# EAGLE design ef01 (EAGLE 7.6.0)
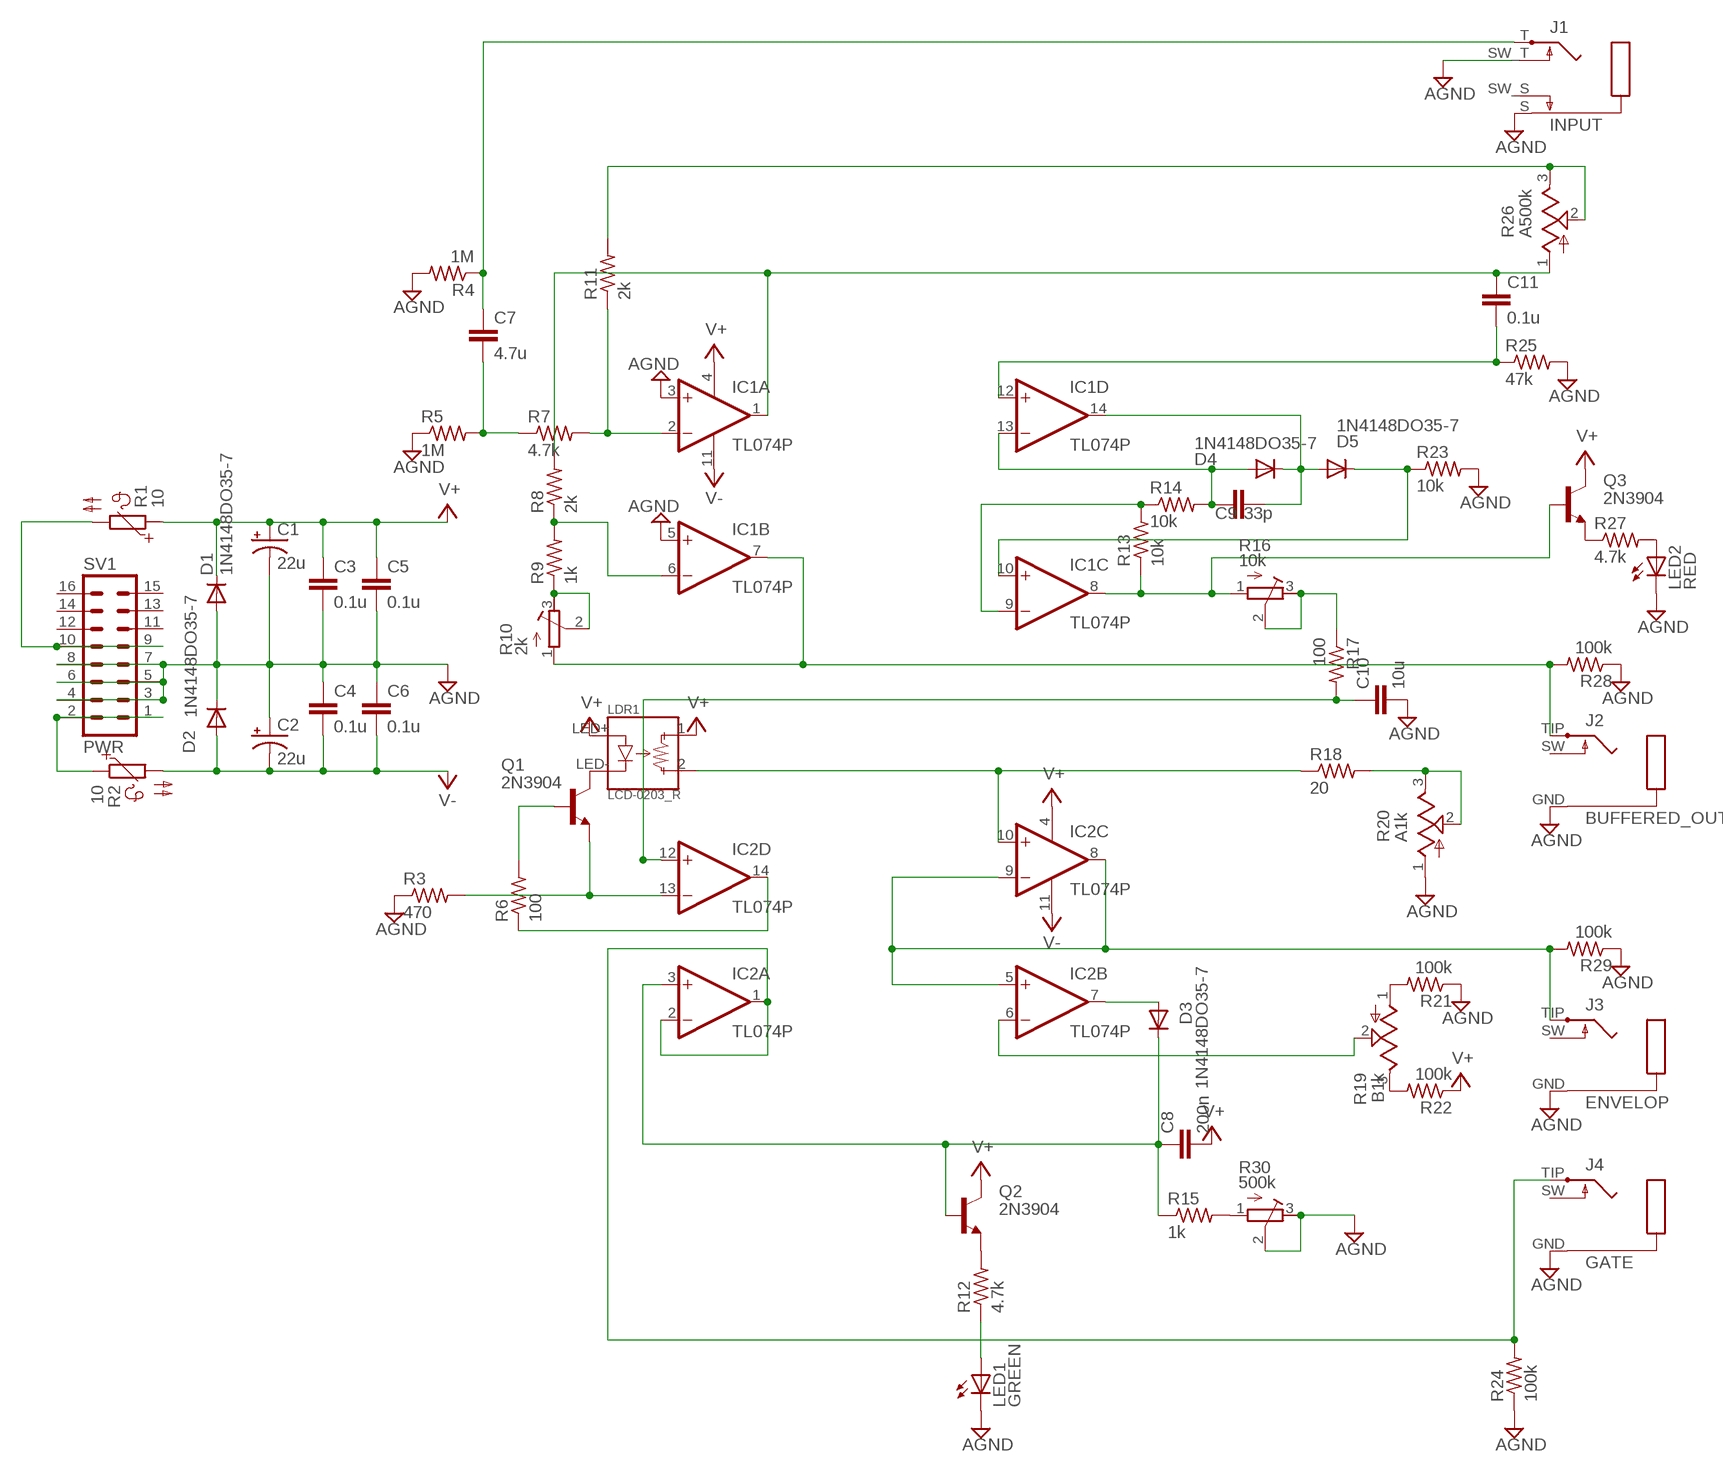
[diagram p0: schematic, sheet 1]

## Parts
C1  22u  CPOL-USE2.5-5  [E2,5-5]
C2  22u  CPOL-USE2.5-5  [E2,5-5]
C3  0.1u  C-EU050-024X044  [C050-024X044]
C4  0.1u  C-EU050-024X044  [C050-024X044]
C5  0.1u  C-EU050-024X044  [C050-024X044]
C6  0.1u  C-EU050-024X044  [C050-024X044]
C7  4.7u  C-EU050-024X044  [C050-024X044]
C8  200n  C-EU050-024X044  [C050-024X044]
C9  33p  C-EU050-024X044  [C050-024X044]
C10  10u  C-EU050-024X044  [C050-024X044]
C11  0.1u  C-EU050-024X044  [C050-024X044]
D1  1N4148DO35-7  [DO35-7]
D2  1N4148DO35-7  [DO35-7]
D3  1N4148DO35-7  [DO35-7]
D4  1N4148DO35-7  [DO35-7]
D5  1N4148DO35-7  [DO35-7]
IC1  TL074P  [DIL14]
IC2  TL074P  [DIL14]
J1  INPUT  ACJM-MHDR  [ACJM-MHDR]
J2  BUFFERED_OUT  35RAPC2AV  [35RAPC2AV]
J3  ENVELOP  35RAPC2AV  [35RAPC2AV]
J4  GATE  35RAPC2AV  [35RAPC2AV]
LDR1  LCD-0203_R  [LCD-0203-R]
LED1  GREEN  LED3MM  [LED3MM]
LED2  RED  LED3MM  [LED3MM]
Q1  2N3904  [TO92]
Q2  2N3904  [TO92]
Q3  2N3904  [TO92]
R1  10  PTC679  [P679]
R2  10  PTC679  [P679]
R3  470  R-US_0204/7  [0204/7]
R4  1M  R-US_0204/7  [0204/7]
R5  1M  R-US_0204/7  [0204/7]
R6  100  R-US_0204/7  [0204/7]
R7  4.7k  R-US_0204/7  [0204/7]
R8  2k  R-US_0204/7  [0204/7]
R9  1k  R-US_0204/7  [0204/7]
R10  2k  GFP063P  [GF063P]
R11  2k  R-US_0204/7  [0204/7]
R12  4.7k  R-US_0204/7  [0204/7]
R13  10k  R-US_0204/7  [0204/7]
R14  10k  R-US_0204/7  [0204/7]
R15  1k  R-US_0204/7  [0204/7]
R16  10k  GFP063P  [GF063P]
R17  100  R-US_0204/7  [0204/7]
R18  20  R-US_0204/7  [0204/7]
R19  B1k  RK097111  [RK097111]
R20  A1k  RK097111  [RK097111]
R21  100k  R-US_0204/7  [0204/7]
R22  100k  R-US_0204/7  [0204/7]
R23  10k  R-US_0204/7  [0204/7]
R24  100k  R-US_0204/7  [0204/7]
R25  47k  R-US_0204/7  [0204/7]
R26  A500k  RK097111  [RK097111]
R27  4.7k  R-US_0204/7  [0204/7]
R28  100k  R-US_0204/7  [0204/7]
R29  100k  R-US_0204/7  [0204/7]
R30  500k  GFP063P  [GF063P]
SV1  PWR  ML16  [ML16]

## Nets
AGND [AGND]: C1.- C2.+ C3.2 C4.1 C5.2 C6.1 C10.2 D1.A D2.C IC1.3(A:+IN) IC1.5(B:+IN) J1.S(GND) J1.SW_T(T_SW) J2.GND J3.GND J4.GND LED1.K(C) LED2.K(C) R3.1 R4.2 R5.1 R20.1 R21.1 R23.2 R24.1 R25.2 R28.1 R29.1 R30.2 R30.3 SV1.3 SV1.4 SV1.5 SV1.6 SV1.7 SV1.8
LDR1: C10.1 IC2.12(D:+IN) R17.2
N$1: C7.1 J1.T(TIP) R4.1
N$2: C7.2 R5.2 R7.1
N$3: Q1.2(B) R6.2
N$4: IC1.6(B:-IN) R8.1 R9.2
N$5: R9.1 R10.2 R10.3
N$6: C11.1 IC1.1(A:OUT) R8.2 R26.1
N$7: IC1.7(B:OUT) J2.TIP R10.1 R28.2
N$8: IC1.2(A:-IN) R7.2 R11.1
N$9: C11.2 IC1.12(D:+IN) R25.1
N$10: C9.1 D4.A IC1.13(D:-IN) R14.2
N$11: IC1.8(C:OUT) Q3.2(B) R13.1 R16.1
N$12: R16.2 R16.3 R17.1
N$13: LDR1.LED-(D-) Q1.1(C)
N$14: IC1.9(C:-IN) R13.2 R14.1
N$15: C9.2 D4.C D5.A IC1.14(D:OUT)
N$16: D5.C IC1.10(C:+IN) R23.1
N$17: Q3.3(E) R27.1
N$18: LED2.A R27.2
N$19: IC2.13(D:-IN) Q1.3(E) R3.2
N$20: IC2.14(D:OUT) R6.1
N$21: R18.2 R20.2 R20.3
N$22: IC2.10(C:+IN) LDR1.2 R18.1
N$23: R15.2 R30.1
N$24: IC2.5(B:+IN) IC2.8(C:OUT) IC2.9(C:-IN) J3.TIP R29.2
N$25: R19.1 R21.2
N$26: R19.3 R22.2
N$27: IC2.6(B:-IN) R19.2
N$28: D3.A IC2.7(B:OUT)
N$29: Q2.3(E) R12.2
N$30: LED1.A R12.1
N$31: C8.1 D3.C IC2.3(A:+IN) Q2.2(B) R15.1
N$32: IC2.1(A:OUT) IC2.2(A:-IN) J4.TIP R24.2
N$33: R2.1 SV1.1 SV1.2
N$35: R1.2 SV1.9 SV1.10
N$46: R11.2 R26.2 R26.3
V+ [V+]: C1.+ C3.1 C5.1 C8.2 D1.C IC1.4(P:V+) IC2.4(P:V+) LDR1.1 LDR1.LED+(D+) Q2.1(C) Q3.1(C) R1.1 R22.1
V- [V-]: C2.- C4.2 C6.2 D2.A IC1.11(P:V-) IC2.11(P:V-) R2.2
Unconnected: J1.SW_S(SW_G) J2.SW J3.SW J4.SW SV1.11 SV1.12 SV1.13 SV1.14 SV1.15 SV1.16

## Library data of the parts
C1 C2 = resistor:CPOL-US: POLARIZED CAPACITOR, American symbol
C3-C11 = rcl:C-EU: CAPACITOR, European symbol
D1-D5 = diode:1N4148: DIODE high speed (Philips)
IC1 IC2 = linear:TL074: OP AMP
J1 = phone-jacks:ACJM-MHDR
J2-J4 = phone-jacks:35RAPC2AV
LDR1 = photo-coupler:LCD-0203_R: LCD-0203 - photo resistor (reversed position)
LED1 LED2 = led:LED: LED OSRAM: - CHIPLED LG R971, LG N971, LY N971, LG Q971, LY Q971, LO R971, LY R971 LH N974, LH R974 LS Q976, LO Q976, LY Q976 LO Q996 - Hyper CHIPLED LW Q18S LB Q993, LB Q99A, LB R99A - SideLED LS A670, LO A670, LY A670, LG A670, LP A670 LB A673, LV A673, LT A673, LW A673 LH A674 LY A675 LS A676, LA A676, LO A676, LY A676, LW A676 LS A679, LY A679, LG A679 - Hyper Micro SIDELED® LS Y876, LA Y876, LO Y876, LY Y876 LT Y87S - SmartLED LW L88C, LW L88S LB L89C, LB L89S, LG L890 LS L89K, LO L89K, LY L89K LS L896, LA L896, LO L896, LY L896 - TOPLED LS T670, LO T670, LY T670, LG T670, LP T670 LSG T670, LSP T670, LSY T670, LOP T670, LYG T670 LG T671, LOG T671, LSG T671 LB T673, LV T673, LT T673, LW T673 LH T674 LS T676, LA T676, LO T676, LY T676, LB T676, LH T676, LSB T676, LW T676 LB T67C, LV T67C, LT T67C, LS T67K, LO T67K, LY T67K, LW E67C LS E67B, LA E67B, LO E67B, LY E67B, LB E67C, LV E67C, LT E67C LW T67C LS T679, LY T679, LG T679 LS T770, LO T770, LY T770, LG T770, LP T770 LB T773, LV T773, LT T773, LW T773 LH T774 LS E675, LA E675, LY E675, LS T675 LS T776, LA T776, LO T776, LY T776, LB T776 LHGB T686 LT T68C, LB T68C - Hyper Mini TOPLED® LB M676 - Mini TOPLED Santana® LG M470 LS M47K, LO M47K, LY M47K Source: http://www.osram.convergy.de LUXEON: - LUMILED® LXK2-PW12-R00, LXK2-PW12-S00, LXK2-PW14-U00, LXK2-PW14-V00 LXK2-PM12-R00, LXK2-PM12-S00, LXK2-PM14-U00 LXK2-PE12-Q00, LXK2-PE12-R00, LXK2-PE12-S00, LXK2-PE14-T00, LXK2-PE14-U00 LXK2-PB12-K00, LXK2-PB12-L00, LXK2-PB12-M00, LXK2-PB14-N00, LXK2-PB14-P00, LXK2-PB14-Q00 LXK2-PR12-L00, LXK2-PR12-M00, LXK2-PR14-Q00, LXK2-PR14-R00 LXK2-PD12-Q00, LXK2-PD12-R00, LXK2-PD12-S00 LXK2-PH12-R00, LXK2-PH12-S00 LXK2-PL12-P00, LXK2-PL12-Q00, LXK2-PL12-R00 Source: www.luxeon.com KINGBRIGHT: KA-3528ASYC Source: www.kingbright.com
Q1-Q3 = transistor-npn:2N3904: NPN Transistor
R1 R2 = ptc-ntc:PTC679: PHILIPS PTC; OC_FARNELL: unknown; OC_NEWARK: unknown
R3-R9 R11-R15 R17 R18 R21-R25 R27-R29 = rcl:R-US_: RESISTOR, American symbol
R10 R16 R30 = trim-resister:GFP063P: TOCOS GF063P - SINGLE TURN CERMET TRIMMER
R19 R20 R26 = trim-resister:RK097111: ALPS RK097111 - 9mm horizontal rotary volume
SV1 = con-ml:ML16: HARTING; OC_FARNELL: unknown; OC_NEWARK: unknown

## Net classes
1 V+: width 1.27 mm
2 V-: width 1.27 mm

## Board
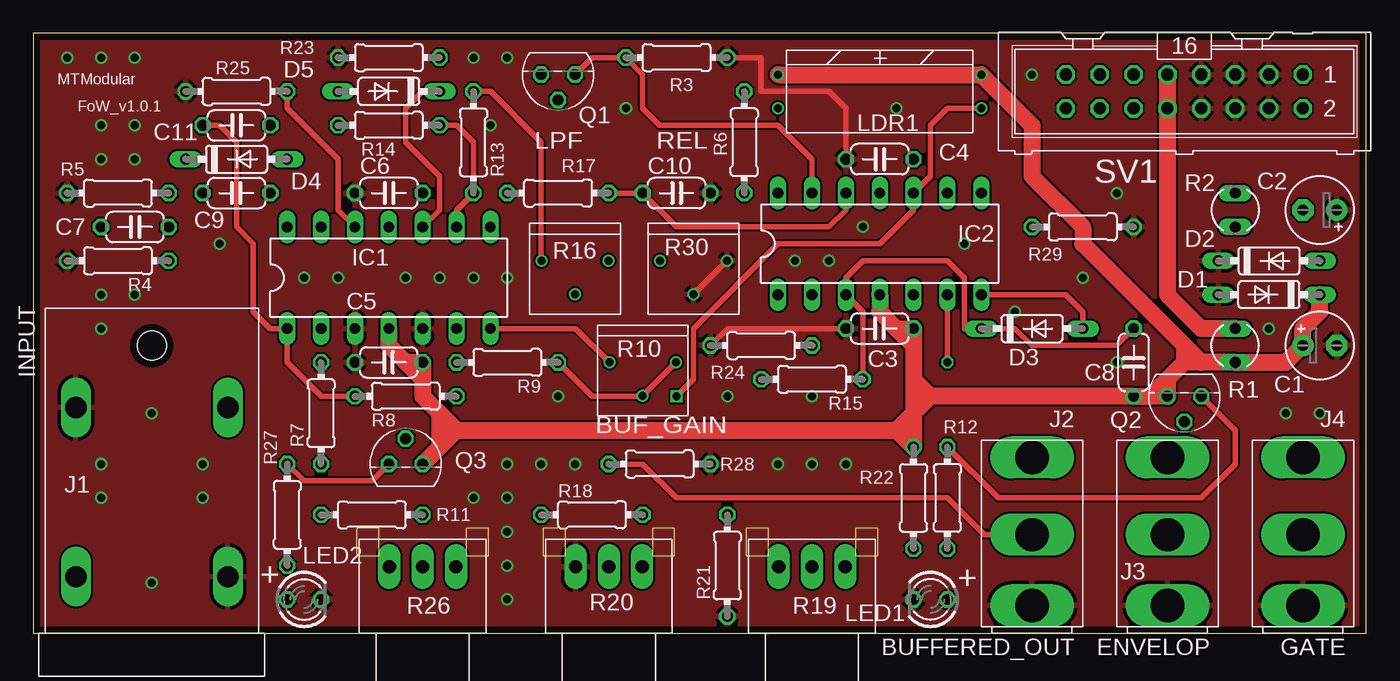
[diagram p1: board, top side]
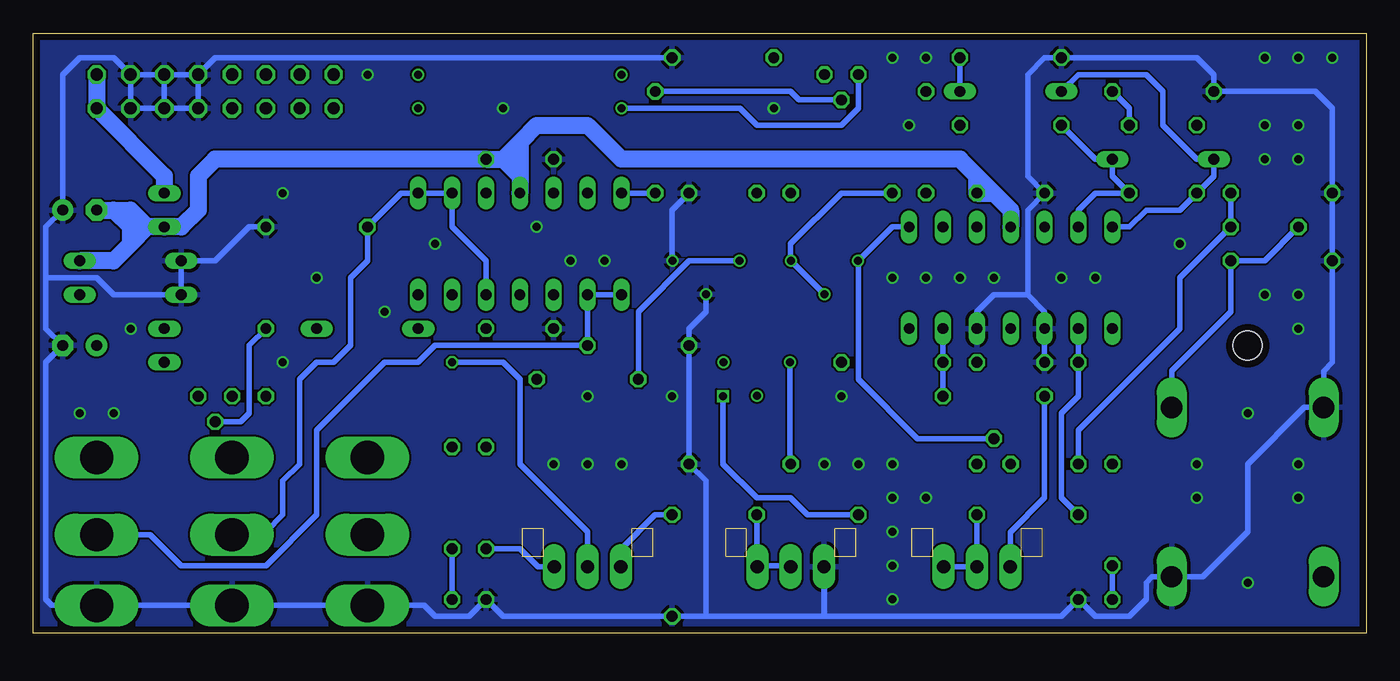
[diagram p2: board, bottom side, seen from below]

Size 100 x 45 mm. Coordinates in mm from the lower left corner, seen from the top.
Outline: 0,0 100,0 100,45 0,45 0,0
Copper layers (1*16): Top 0.035mm / dielectric 1.6mm / Bottom 0.035mm
Design rules "Elecrow_2-layer_PCB_eagle_rule *": minimum track width 6mil, minimum drill 12mil, track to track 6mil, track to pad 6mil, pad to pad 6mil, via to via 8mil, smd to smd 0mil, copper to edge 20mil, drill to drill 10mil, minimum pad ring 6mil, minimum via ring 6mil, stop-mask expansion 0mil, vias tented up to drill 100mil, thermal gap 10mil

### Footprints (pad centres in the part's own frame; a part is rotated, then mirrored left to right if it is on the bottom)
E2,5-5 = drill 0.813 pad 1.6: + -1.27,0 | drill 0.813 pad 1.6 octagon: - 1.27,0
C050-024X044 = drill 0.813 octagon: 1 -2.54,0; 2 2.54,0
DO35-7 = drill 0.813 long: A 3.81,0; C -3.81,0
DIL14 = drill 0.813 long: 1 -7.62,-3.81; 2 -5.08,-3.81; 3 -2.54,-3.81; 4 0,-3.81; 5 2.54,-3.81; 6 5.08,-3.81; 7 7.62,-3.81; 8 7.62,3.81; 9 5.08,3.81; 10 2.54,3.81; 11 0,3.81; 12 -2.54,3.81; 13 -5.08,3.81; 14 -7.62,3.81
ACJM-MHDR = drill 1.6 long: S 6.35,5.7; SW_S 6.35,-5.7; SW_T -6.35,-5.7; T -6.35,5.7 | hole 2.2: -10.98,0
35RAPC2AV = drill 2.5 long: GND 0,5.3; SW 0,-5.8; TIP 0,0
LCD-0203-R = drill 0.6: 1 -7.62,-1.27; 2 -7.62,1.27; LED+ 7.62,-1.27; LED- 7.62,1.27
LED3MM = drill 0.813 octagon: A -1.27,0; K 1.27,0
TO92 = drill 0.813 octagon: 1 1.27,0; 2 0,1.905; 3 -1.27,0
P679 = drill 0.813 long: 1 -1.27,0; 2 1.27,0
0204/7 = drill 0.813 octagon: 1 -3.81,0; 2 3.81,0
GF063P = drill 0.6: 1 2.5,0; 2 0,2.5; 3 -2.5,0
RK097111 = drill 1 pad 1.676 long: 1 -5,-2.5; 2 -5,0; 3 -5,2.5
ML16 = drill 0.914 octagon: 1 -8.89,-1.27; 2 -8.89,1.27; 3 -6.35,-1.27; 4 -6.35,1.27; 5 -3.81,-1.27; 6 -3.81,1.27; 7 -1.27,-1.27; 8 -1.27,1.27; 9 1.27,-1.27; 10 1.27,1.27; 11 3.81,-1.27; 12 3.81,1.27; 13 6.35,-1.27; 14 6.35,1.27; 15 8.89,-1.27; 16 8.89,1.27

### Placement (x,y rotation side)
C1  96.52,21.59 0 top
C2  96.52,31.75 180 top
C3  63.5,22.86 180 top
C4  63.5,35.56 0 top
C5  26.67,20.32 180 top
C6  26.67,33.02 0 top
C7  7.62,30.48 0 top
C8  82.55,20.32 270 top
C9  15.24,33.02 180 top
C10  48.26,33.02 0 top
C11  15.24,38.1 0 top
D1  92.71,25.4 180 top
D2  92.71,27.94 0 top
D3  74.93,22.86 0 top
D4  15.24,35.56 0 top
D5  26.67,40.64 180 top
IC1  26.67,26.67 0 top
IC2  63.5,29.21 0 top
J1  8.89,10.6 270 top
J2  74.93,7.4 180 top
J3  85.09,7.4 180 top
J4  95.25,7.4 180 top
LDR1  63.5,40.64 180 top
LED1  67.31,2.54 180 top
LED2  20.32,2.54 0 top
Q1  39.37,41.91 180 top
Q2  86.36,17.78 180 top
Q3  27.94,12.7 0 top
R1  90.17,21.59 90 top
R2  90.17,31.75 270 top
R3  48.26,43.18 180 top
R4  6.35,27.94 180 top
R5  6.35,33.02 0 top
R6  53.34,36.83 90 top
R7  21.59,16.51 90 top
R8  27.94,17.78 180 top
R9  35.56,20.32 180 top
R10  45.72,20.32 180 top
R11  25.4,8.89 0 top
R12  68.58,10.16 90 top
R13  33.02,36.83 270 top
R14  26.67,38.1 180 top
R15  58.42,19.05 180 top
R16  40.64,27.94 180 top
R17  39.37,33.02 0 top
R18  41.91,8.89 0 top
R19  58.42,0 270 top
R20  43.18,0 270 top
R21  52.07,5.08 90 top
R22  66.04,10.16 270 top
R23  26.67,43.18 180 top
R24  54.61,21.59 0 top
R25  15.24,40.64 180 top
R26  29.21,0 270 top
R27  19.05,8.89 270 top
R28  46.99,12.7 180 top
R29  78.74,30.48 180 top
R30  49.53,27.94 180 top
SV1  86.36,40.64 180 top

### Tracks (layer width: path | path; a pad name or v marks a point on that pad's centre or on a via)
AGND  (via drill 0.6)
  Top 0.406: R30.2 R30.3 | C4.1 60.96,39.37 59.69,40.64 54.61,40.64 54.61,43.18 R3.1 | C3.2 52.07,22.86 R24.1
  Bottom 0.406: 99.06,26.67 99.06,22.86 C1.- 99.06,20.32 99.06,2.54 98.62,2.1 J4.GND J2.GND 70.68,2.1 69.85,1.27 67.31,1.27 LED1.K 64.77,1.27 R21.1 49.53,1.27 | 99.06,26.67 99.06,30.48 C2.+ 97.79,41.91 96.52,43.18 93.98,43.18 SV1.3 | SV1.3 SV1.4 SV1.6 | SV1.6 SV1.8 SV1.7 | SV1.7 SV1.5 | SV1.5 SV1.3 | SV1.5 SV1.6 | 49.53,1.27 40.64,1.27 | 40.64,1.27 40.64,4.96 R20.1 40.68,1.31 40.64,1.27 | 40.64,1.27 22.86,1.27 LED2.K 20.32,1.27 17.78,1.27 16.51,2.54 16.51,3.81 16.07,4.25 J1.S 12.26,4.25 8.89,7.62 8.89,12.7 4.64,16.95 J1.SW_T 3.19,19.67 2.54,20.32 R4.2 2.54,39.37 3.81,40.64 R25.2 11.43,41.91 12.7,43.18 R23.2 24.13,43.18 25.4,41.91 25.4,34.29 C6.1 25.4,31.75 25.4,25.4 | R3.1 86.36,43.18 SV1.7 | IC1.5 29.21,24.13 27.94,25.4 25.4,25.4 | 25.4,25.4 24.13,24.13 C5.2 | R29.1 83.82,30.48 86.36,27.94 D2.C D1.A 93.98,25.4 95.25,26.67 99.06,26.67 | R30.2 49.53,24.13 50.8,22.86 R24.1 R28.1 49.53,11.43 49.53,1.27 | C10.2 52.07,31.75 52.07,27.98 R30.3
  other vias: 73.66,24.13 81.28,20.32 44.45,39.37 96.52,16.51 93.98,16.51 60.96,12.7 58.42,12.7 55.88,12.7 40.64,12.7 38.1,12.7 35.56,12.7 35.56,10.16 35.56,7.62 35.56,5.08 8.89,3.81 12.7,10.16 12.7,12.7 5.08,12.7 5.08,10.16 8.89,16.51 5.08,22.86 7.62,35.56 7.62,38.1 7.62,43.18 5.08,43.18 2.54,43.18 5.08,38.1 5.08,35.56 64.77,39.37 35.56,43.18 33.02,26.67 30.48,26.67 27.94,26.67 22.86,26.67 20.32,26.67 35.56,26.67 69.85,29.21 81.28,33.02 74.93,41.91 78.74,26.67 52.07,17.78 35.56,2.54 39.37,17.78 34.29,38.1 62.23,30.48 59.69,27.94 57.15,27.94 58.42,17.78 92.71,22.86 33.02,10.16 13.97,29.21 5.08,25.4 7.62,25.4 33.02,43.18
  pour Bottom: 0,45 100,45 100,0 0,0
  pour Top: 0,45 100,45 100,0 0,0
LDR1
  Top 0.406: R17.2 C10.1 48.26,30.48 59.69,30.48 60.96,31.75 IC2.12
N$1
  Bottom 0.406: J1.T 14.59,19.7 10.16,24.13 R4.1 7.62,27.94 C7.1
N$2
  Bottom 0.406: R7.1 21.59,15.24 13.97,22.86 13.97,26.67 C7.2 R5.2
N$3
  Bottom 0.406: Q1.2 42.55,40.01 43.18,40.64 R6.2
N$4
  Bottom 0.406: IC1.6 R9.2 R8.1
N$5
  Top 0.406: R9.1 41.91,17.78 45.68,17.78 R10.2 R10.3
N$6
  Top 0.406: R8.2 21.59,17.78 19.05,20.32 IC1.1 17.78,22.86 16.51,24.13 16.51,29.21 15.24,30.48 15.24,36.83 13.97,38.1 C11.1
  Bottom 0.406: R8.2 24.13,10.16 26.71,7.58 R26.1
N$7
  Top 0.406: 43.18,20.32 R10.1 40.68,22.86 IC1.7 | J2.TIP 71.34,7.4 68.58,10.16 48.26,10.16 45.72,12.7 R28.2
  Bottom 0.406: R10.1 43.22,12.74 R28.2
N$8
  Bottom 0.406: IC1.2 R7.2 21.59,17.78 22.86,16.51 22.86,10.16 R11.1
N$9
  Top 0.406: IC1.12 22.86,31.75 22.86,35.56 19.05,39.37 R25.1
  Bottom 0.406: C11.2 17.78,39.37 R25.1
N$10
  Bottom 0.406: R14.2 20.32,35.56 D4.A 19.05,34.29 C9.1 20.32,33.02 21.59,31.75 IC1.13
N$11
  Top 0.406: R16.1 38.1,27.98 38.1,36.83 34.29,40.64 R13.1
  Bottom 0.406: Q3.2 33.66,14.61 38.1,19.05 38.1,27.9 R16.1 38.1,27.94 35.56,30.48 IC1.8
N$12
  Bottom 0.406: R17.1 39.37,33.02 43.18,29.21 43.18,27.98 R16.3 R16.2
N$13
  Bottom 0.406: LDR1.LED- 46.99,39.37 45.72,38.1 39.37,38.1 38.1,39.37 Q1.1
N$14
  Top 0.406: IC1.9 31.75,31.75 R13.2 33.02,36.83 31.75,38.1 R14.1
N$15
  Bottom 0.406: IC1.14 17.78,30.48 16.51,31.75 13.97,31.75 C9.2 11.43,34.29 D4.C 12.7,35.56 15.24,38.1 15.24,40.64 16.51,41.91 21.59,41.91 D5.A
N$16
  Top 0.406: IC1.10 30.48,31.75 30.48,34.29 27.94,36.83 27.94,39.37 29.21,40.64 D5.C
  Bottom 0.406: R23.1 D5.C
N$17
  Top 0.406: R27.1 20.32,11.43 25.4,11.43 Q3.3
N$18
  Bottom 0.406: LED2.A R27.2
N$19
  Top 0.406: Q1.3 41.91,43.18 R3.2 45.72,41.91 45.72,39.37 46.99,38.1 55.88,38.1 58.42,35.56 IC2.13
N$20
  Bottom 0.406: IC2.14 R6.1
N$21
  Bottom 0.406: R18.2 45.72,5.04 R20.3 45.6,5.08 43.18,5.08 R20.2
N$22  (via drill 0.6)
  Top 0.406: v48.26,17.78 49.53,19.05 49.53,22.86 55.88,29.21 63.5,29.21 66.04,31.75 IC2.10 67.31,34.29 67.31,38.1 68.58,39.37 LDR1.2
  Bottom 0.406: R18.1 41.91,8.89 43.18,10.16 45.72,10.16 48.26,12.7 v48.26,17.78
N$23
  Bottom 0.406: R30.1 50.8,27.94 54.61,24.13 R15.2
N$24
  Bottom 0.406: IC2.5 66.04,27.94 68.58,30.48 IC2.9 IC2.8 72.39,33.02 R29.2 74.93,27.94 76.2,26.67 76.2,21.59 77.47,20.32 78.74,20.32 80.01,19.05 80.01,12.7 81.28,11.43 81.28,8.89 82.55,7.62 85.09,7.62 J3.TIP
N$25
  Bottom 0.406: R19.1 55.92,6.31 53.34,8.89 R21.2
N$26
  Bottom 0.406: R19.3 62.15,5 63.5,6.35 R22.2
N$27  (via drill 0.6)
  Top 0.406: IC2.6 v68.58,20.32
  Bottom 0.406: v68.58,20.32 64.77,20.32 63.5,19.05 63.5,12.7 58.42,7.62 R19.2
N$28
  Top 0.406: 77.47,22.86 D3.A 78.74,24.13 77.47,25.4 IC2.7
N$29
  Top 0.406: Q2.3 90.17,15.24 90.17,12.7 87.63,10.16 72.39,10.16 R12.2
N$30
  Bottom 0.406: R12.1 LED1.A
N$31
  Top 0.406: R15.1 62.23,24.13 IC2.3 60.96,26.67 62.23,27.94 68.58,27.94 69.85,26.67 69.85,22.86 D3.C 73.66,22.86 74.93,21.59 81.28,21.59 C8.1
  Bottom 0.406: Q2.2 84.45,15.88 83.82,16.51 83.82,21.59 C8.1
N$32
  Bottom 0.406: IC2.1 IC2.2 R24.2 69.85,21.59 71.12,20.32 73.66,20.32 78.74,15.24 78.74,8.89 82.55,5.08 88.9,5.08 91.22,7.4 J4.TIP
N$33
  Bottom 1.27: SV1.1 SV1.2 90.17,34.29 R2.1
N$35
  Top 1.27: SV1.9 SV1.10 85.09,25.4 87.63,22.86 R1.2
N$46
  Bottom 0.406: R26.3 R26.2 R11.2
V+
  Top 1.27: D1.C 96.52,24.13 95.25,22.86 C1.+ 93.98,20.32 R1.1 87.63,20.32 | LDR1.LED+ LDR1.1 74.93,38.1 74.93,34.29 78.74,30.48 78.74,29.21 86.36,21.59 | IC1.4 26.67,21.59 27.94,20.32 | 27.94,20.32 C5.1 29.21,19.05 | 29.21,19.05 29.21,17.78 30.48,16.51 | 30.48,16.51 31.75,15.24 | Q3.1 30.48,13.97 | 30.48,13.97 31.75,15.24 | 30.48,16.51 30.48,13.97 | IC2.4 63.5,24.13 64.77,22.86 | 64.77,22.86 C3.1 66.04,21.59 | 83.82,17.78 C8.2 67.31,17.78 | 83.82,17.78 Q2.1 85.09,19.05 | 67.31,17.78 66.04,16.51 | 66.04,16.51 66.04,15.24 | 87.63,20.32 86.36,20.32 | 86.36,20.32 85.09,19.05 | 66.04,21.59 66.04,19.05 | 66.04,19.05 66.04,16.51 | 66.04,15.24 R22.1 64.77,15.24 | 31.75,15.24 64.77,15.24 | 64.77,15.24 66.04,16.51 | 86.36,21.59 87.63,20.32 | 67.31,17.78 66.04,19.05 | 66.04,15.24 64.77,15.24 | 85.09,19.05 83.82,17.78 | 86.36,21.59 86.36,20.32 | 64.77,22.86 66.04,21.59 | 27.94,20.32 29.21,19.05
V-
  Bottom 1.27: 91.44,30.48 R2.2 88.9,30.48 87.63,31.75 87.63,34.29 86.36,35.56 C4.2 64.77,35.56 | 91.44,30.48 92.71,29.21 | 92.71,29.21 93.98,27.94 D2.A | C2.- 93.98,31.75 | 93.98,31.75 92.71,31.75 | 92.71,31.75 91.44,30.48 | 27.94,33.02 C6.2 29.21,34.29 | 27.94,33.02 26.67,31.75 IC1.11 | 92.71,31.75 92.71,30.48 | 92.71,29.21 92.71,30.48 | 93.98,31.75 92.71,30.48 | 29.21,34.29 30.48,35.56 55.88,35.56 58.42,38.1 62.23,38.1 63.5,36.83 | 63.5,36.83 63.5,35.56 | 63.5,35.56 63.5,34.29 | 63.5,34.29 IC2.11 | 64.77,35.56 63.5,35.56 | 29.21,34.29 27.94,33.02 | 63.5,36.83 64.77,35.56 | 64.77,35.56 63.5,34.29

### Text on the board
tNames: MTModular | FoW_v1.0.1 | LPF | REL | BUF_GAIN | + | +